# EAGLE schematic Eshaan - DIYpiano (EAGLE 9.2.2)
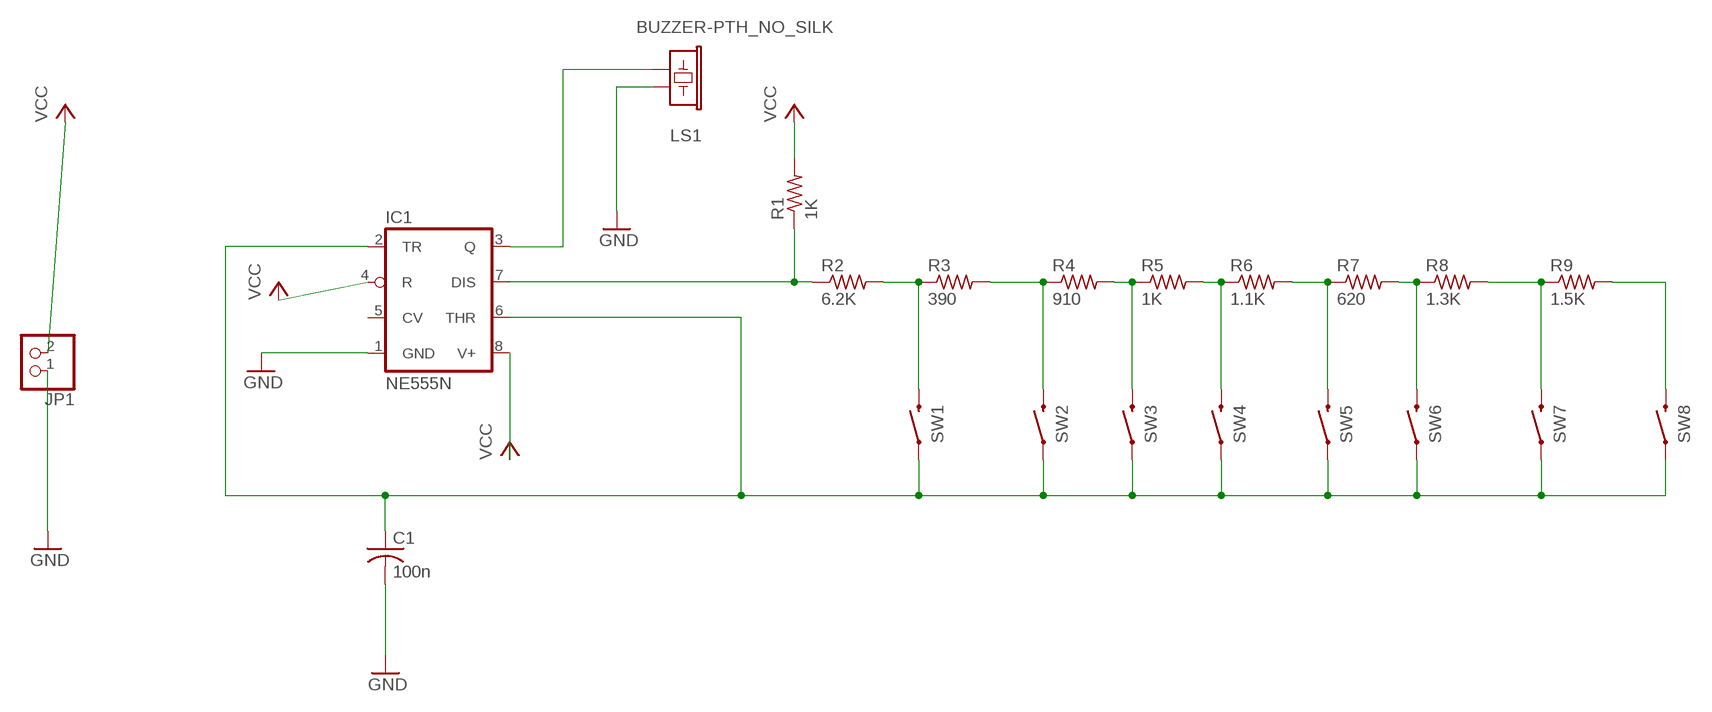
[diagram p0: schematic, sheet 1]

## Parts
C1  100n  C-US025-025X050  [C025-025X050]
IC1  NE555N  [DIL08]
JP1  PINHD-1X2  [1X02]
LS1  BUZZER-PTH_NO_SILK  [BUZZER-12MM-NS]
R1  1K  R-US_0207/10  [0207/10]
R2  6.2K  R-US_0207/10  [0207/10]
R3  390  R-US_0207/10  [0207/10]
R4  910  R-US_0207/10  [0207/10]
R5  1K  R-US_0207/10  [0207/10]
R6  1.1K  R-US_0207/10  [0207/10]
R7  620  R-US_0207/10  [0207/10]
R8  1.3K  R-US_0207/10  [0207/10]
R9  1.5K  R-US_0207/10  [0207/10]
SW1  MOMENTARY-SWITCH-SPST-PTH-6.0MM  [TACTILE_SWITCH_PTH_6.0MM]
SW2  MOMENTARY-SWITCH-SPST-PTH-6.0MM  [TACTILE_SWITCH_PTH_6.0MM]
SW3  MOMENTARY-SWITCH-SPST-PTH-6.0MM  [TACTILE_SWITCH_PTH_6.0MM]
SW4  MOMENTARY-SWITCH-SPST-PTH-6.0MM  [TACTILE_SWITCH_PTH_6.0MM]
SW5  MOMENTARY-SWITCH-SPST-PTH-6.0MM  [TACTILE_SWITCH_PTH_6.0MM]
SW6  MOMENTARY-SWITCH-SPST-PTH-6.0MM  [TACTILE_SWITCH_PTH_6.0MM]
SW7  MOMENTARY-SWITCH-SPST-PTH-6.0MM  [TACTILE_SWITCH_PTH_6.0MM]
SW8  MOMENTARY-SWITCH-SPST-PTH-6.0MM  [TACTILE_SWITCH_PTH_6.0MM]

## Nets
GND: C1.2 IC1.1(GND) JP1.1 LS1.-
N$1: R2.2 R3.1 SW1.3
N$2: IC1.7(DIS) R1.1 R2.1
N$3: C1.1 IC1.2(TR) IC1.6(THR) SW1.1 SW2.1 SW3.1 SW4.1 SW5.1 SW6.1 SW7.1 SW8.1
N$4: R3.2 R4.1 SW2.3
N$5: R4.2 R5.1 SW3.3
N$6: R5.2 R6.1 SW4.3
N$7: R6.2 R7.1 SW5.3
N$8: R7.2 R8.1 SW6.3
N$9: R8.2 R9.1 SW7.3
N$10: R9.2 SW8.3
N$11: IC1.3(Q) LS1.+
VCC: IC1.4(R) IC1.8(V+) JP1.2 R1.2
Unconnected: IC1.5(CV)

## Library data of the parts
C1 = rcl:C-US: CAPACITOR, American symbol; OC_NEWARK: unknown; SPICEPREFIX: C
IC1 = linear:*555: TIMER; OC_NEWARK: unknown
JP1 = pinhead:PINHD-1X2: PIN HEADER; OC_NEWARK: unknown
LS1 = SparkFun-Electromechanical:BUZZER: Buzzer Small round buzzers that operate around the audible 2kHz range. You can use these as speakers to create simple music or user interfaces. Variant Overview: PTH - Mini Speaker - PC Mount 12mm 2.048kHz <https://www.sparkfun.com/products/7950> PTH_KIT - Mini Speaker - PC Mount 12mm 2.048kHz <https://www.sparkfun.com/products/7950> KIT simplifies soldering by adding stop mask to one side of the pads. PTH_NO_SILK - Mini Speaker - PC Mount 12mm 2.048kHz <https://www.sparkfun.com/products/7950> No silkscreen indicator of buzzer outline. PTH_KIT_NO_SILK - Mini Speaker - PC Mount 12mm 2.048kHz <https://www.sparkfun.com/products/7950> KIT package w/o silkscreen SMD - Buzzer Audio Magnetic (CCV-084B16) SMD buzzer used on, e.g. the LilyPad Buzzer <https://www.sparkfun.com/products/8463> and RFID USB Reader <https://www.sparkfun.com/products/9963>. SMD_KIT - Buzzer Audio Magnetic (CCV-084B16) SMD Buzzer with elongated pins to make soldering easier. Used on the SparkFun Simon Says - Surface Mount Soldering Kit <https://www.sparkfun.com/products/10935>.; OC_NEWARK: unknown; PROD_ID: COMP-08253; SF_SKU: COM-07950
R1-R9 = rcl:R-US_: RESISTOR, American symbol; OC_NEWARK: unknown; SPICEPREFIX: R
SW1-SW8 = SparkFun-Switches:MOMENTARY-SWITCH-SPST: Momentary Switch (Pushbutton) - SPST Normally-open (NO) SPST momentary switches (buttons, pushbuttons). Variants PTH-12MM - 12mm square, through-hole Momentary Pushbutton Switch - 12mm Square <https://www.sparkfun.com/products/9190> (COM-09190) PTH-6.0MM, PTH-6.0MM-KIT - 6.0mm square, through-hole Mini Pushbutton Switch <https://www.sparkfun.com/products/97> (COM-00097) KIT package intended for soldering kit's - only one side of pads' copper is exposed. PTH-RIGHT-ANGLE-KIT - Right-angle, through-hole Right Angle Tactile Button <https://www.sparkfun.com/products/10791> - Used on SparkFun BigTime Watch Kit <https://www.sparkfun.com/products/11734> SMD-12MM - 12mm square, surface-mount Tactile Button - SMD (12mm) <https://www.sparkfun.com/products/12993> (COM-12993) Used on SparkFun PicoBoard <https://www.sparkfun.com/products/11888> SMD-4.5MM - 4.5mm Square Trackball Switch Used on SparkFun Blackberry Trackballer Breakout <https://www.sparkfun.com/products/13169> SMD-4.6MMX2.8MM - 4.60mm x 2.80mm, surface mount Used on SparkFun SAMD21 Mini Breakout <https://www.sparkfun.com/products/13664> SMD-5.2MM, SMD-5.2-REDUNDANT - 5.2mm square, surface-mount Mini Pushbutton Switch - SMD <https://www.sparkfun.com/products/8720> (COM-08720) Used on Arduino Pro Mini <https://www.sparkfun.com/products/11114> REDUNDANT package connects both switch circuits together SMD-6.0X3.5MM - 6.0 x 3.5mm, surface mount Momentary Reset Switch SMD <https://www.sparkfun.com/products/8229> (COM-08229) SMD-6.2MM-TALL - 6.2mm square, surface mount Tactile Button - SMD (6mm) <https://www.sparkfun.com/products/12992> Used on SparkFun Digital Sandbox <https://www.sparkfun.com/products/12651> SMD-RIGHT-ANGLE - Right-angle, surface mount Used on SparkFun Block for Intel® Edison - Arduino <https://www.sparkfun.com/products/13036>; OC_NEWARK: unknown; PROD_ID: SWCH-08441; SF_SKU: COM-00097

## Net classes
0 default: width 0.305 mm, drill 0.508 mm, clearance 0.508 mm